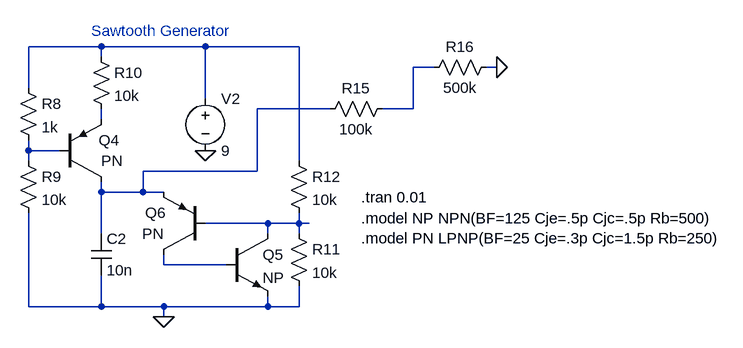
[diagram p0: schematic Sawtooth.asc]
Sawtooth.asc, the LTspice schematic file:
Version 4
SHEET 1 2644 1636
WIRE 416 -480 304 -480
WIRE 576 -480 416 -480
WIRE 720 -480 576 -480
WIRE 416 -464 416 -480
WIRE 928 -448 896 -448
WIRE 1024 -448 1008 -448
WIRE 304 -416 304 -480
WIRE 576 -400 576 -480
WIRE 768 -384 656 -384
WIRE 896 -384 896 -448
WIRE 896 -384 848 -384
WIRE 416 -368 416 -384
WIRE 304 -320 304 -336
WIRE 352 -320 304 -320
WIRE 304 -304 304 -320
WIRE 720 -304 720 -480
WIRE 656 -288 656 -384
WIRE 656 -288 480 -288
WIRE 416 -256 416 -272
WIRE 480 -256 480 -288
WIRE 480 -256 416 -256
WIRE 512 -256 480 -256
WIRE 672 -208 576 -208
WIRE 720 -208 720 -224
WIRE 720 -208 672 -208
WIRE 736 -208 720 -208
WIRE 416 -192 416 -256
WIRE 672 -192 672 -208
WIRE 720 -192 720 -208
WIRE 512 -144 512 -160
WIRE 608 -144 512 -144
WIRE 304 -80 304 -224
WIRE 416 -80 416 -128
WIRE 416 -80 304 -80
WIRE 512 -80 416 -80
WIRE 672 -80 672 -96
WIRE 672 -80 512 -80
WIRE 720 -80 720 -112
WIRE 720 -80 672 -80
WIRE 512 -64 512 -80
FLAG 576 -320 0
FLAG 512 -64 0
FLAG 1024 -448 0
SYMBOL voltage 576 -416 R0
WINDOW 123 0 0 Left 0
WINDOW 39 0 0 Left 0
SYMATTR InstName V2
SYMATTR Value 9
SYMBOL res 288 -432 R0
SYMATTR InstName R8
SYMATTR Value 1k
SYMBOL res 288 -320 R0
SYMATTR InstName R9
SYMATTR Value 10k
SYMBOL res 400 -480 R0
SYMATTR InstName R10
SYMATTR Value 10k
SYMBOL cap 400 -192 R0
SYMATTR InstName C2
SYMATTR Value 10n
SYMBOL pnp 352 -272 M180
WINDOW 0 60 64 Left 2
WINDOW 3 64 32 Left 2
SYMATTR InstName Q4
SYMATTR Value PN
SYMBOL npn 608 -192 R0
SYMATTR InstName Q5
SYMATTR Value NP
SYMBOL pnp 576 -160 R180
WINDOW 0 60 64 Left 2
WINDOW 3 64 32 Left 2
SYMATTR InstName Q6
SYMATTR Value PN
SYMBOL res 704 -208 R0
SYMATTR InstName R11
SYMATTR Value 10k
SYMBOL res 704 -320 R0
SYMATTR InstName R12
SYMATTR Value 10k
SYMBOL res 752 -368 R270
WINDOW 0 32 56 VTop 2
WINDOW 3 0 56 VBottom 2
SYMATTR InstName R15
SYMATTR Value 100k
SYMBOL res 912 -432 R270
WINDOW 0 32 56 VTop 2
WINDOW 3 0 56 VBottom 2
SYMATTR InstName R16
SYMATTR Value 500k
TEXT 816 -248 Left 2 !.tran 0.01
TEXT 816 -216 Left 2 !.model NP NPN(BF=125 Cje=.5p Cjc=.5p Rb=500)\n.model PN LPNP(BF=25 Cje=.3p Cjc=1.5p Rb=250)
TEXT 400 -504 Left 2 ;Sawtooth Generator

The netlist it stands for:
* Sawtooth.asc
V2 N001 0 9
R8 N001 N005 1k
R9 N005 0 10k
R10 N001 N004 10k
C2 N003 0 10n
Q4 N003 N005 N004 0 PN
Q5 N006 N007 0 0 NP
Q6 N007 N006 N003 0 PN
R11 N006 0 10k
R12 N001 N006 10k
R15 N003 N002 100k
R16 N002 0 500k
.model NPN NPN
.model PNP PNP
.lib standard.bjt
.tran 0.01
.model NP NPN(BF=125 Cje=.5p Cjc=.5p Rb=500)
.model PN LPNP(BF=25 Cje=.3p Cjc=1.5p Rb=250)
* Sawtooth Generator
.backanno
.end